# Altium project programmer.PrjPcb
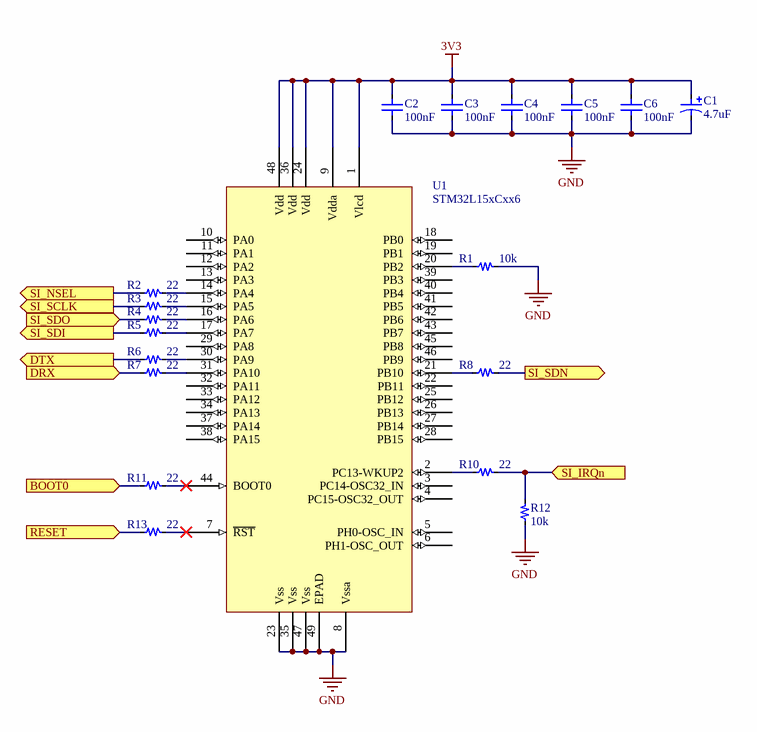
[diagram p0: microcontroller.SchDoc]
ProjectDate: 30/05/2018; ProjectDescription: Oxidane module programmer; ProjectLicense: GPL; ProjectPCBRev: A; ProjectRevision: 0; ProjectTitle: Rusty
2 sheets, 38 parts. Net scope: flat (ports and power ports of the same name join across sheets).
Board file: board.PcbDoc
Sheets:
  microcontroller.SchDoc
  radio.SchDoc

## Sheet microcontroller.SchDoc: Microcontroller
size A4; Author: Pietro Lorefice; DocumentNumber: 2; Revision: A; SheetNumber: 2; SheetTotal: 3

### Parts
C1  4.7uF  [0603_[1608]]
C2  100nF  [0402_[1005]]
C3  100nF  [0402_[1005]]
C4  100nF  [0402_[1005]]
C5  100nF  [0402_[1005]]
C6  100nF  [0402_[1005]]
R1  10k  [0402_[1005]]
R2  22  [0402_[1005]]
R3  22  [0402_[1005]]
R4  22  [0402_[1005]]
R5  22  [0402_[1005]]
R6  22  [0402_[1005]]
R7  22  [0402_[1005]]
R8  22  [0402_[1005]]
R10  22  [0402_[1005]]
R11  22  [0402_[1005]]
R12  10k  [0402_[1005]]
R13  22  [0402_[1005]]
U1  STM32L15xCxx6  [QFN50P700X700X60_HS-49N]

### Ports
BOOT0 (in), DRX (in), DTX (out), RESET (in), SI_IRQn (in), SI_NSEL (out), SI_SCLK (out), SI_SDI (out), SI_SDN (out), SI_SDO (in)

### Nets
3V3: C1.1 C2.2 C3.2 C4.2 C5.2 C6.2 U1.1(Vlcd) U1.9(Vdda) U1.24(Vdd) U1.36(Vdd) U1.48(Vdd)
GND: C1.2 C2.1 C3.1 C4.1 C5.1 C6.1 R1.2 R12.1 U1.8(Vssa) U1.23(Vss) U1.35(Vss) U1.47(Vss) U1.49(EPAD)
BOOT0: R11.1 ; port BOOT0
DRX: R7.1 ; port DRX
DTX: R6.1 ; port DTX
RESET: R13.1 ; port RESET
SI_IRQn: R10.2 R12.2 ; port SI_IRQn
SI_NSEL: R2.1 ; port SI_NSEL
SI_SCLK: R3.1 ; port SI_SCLK
SI_SDI: R5.1 ; port SI_SDI
SI_SDN: R8.2 ; port SI_SDN
SI_SDO: R4.1 ; port SI_SDO
NetR1_1: R1.1 U1.20(PB2)
NetR2_2: R2.2 U1.14(PA4)
NetR3_2: R3.2 U1.15(PA5)
NetR4_2: R4.2 U1.16(PA6)
NetR5_2: R5.2 U1.17(PA7)
NetR6_2: R6.2 U1.30(PA9)
NetR7_2: R7.2 U1.31(PA10)
NetR8_1: R8.1 U1.21(PB10)
NetR10_1: R10.1 U1.2(PC13-WKUP2)
NetR11_2: R11.2 U1.44(BOOT0)
NetR13_2: R13.2 U1.7(~{RST})

Not connected (* = marked no-connect by the designer): U1 3(PC14-OSC32_IN) 4(PC15-OSC32_OUT) 5(PH0-OSC_IN) 6(PH1-OSC_OUT) 10(PA0) 11(PA1) 12(PA2) 13(PA3) 18(PB0) 19(PB1) 22(PB11) 25(PB12) 26(PB13) 27(PB14) 28(PB15) 29(PA8) 32(PA11) 33(PA12) 34(PA13) 37(PA14) 38(PA15) 39(PB3) 40(PB4) 41(PB5) 42(PB6) 43(PB7) 45(PB8) 46(PB9)

### Notes on the sheet
- Title
- Project
- Size:
- Date:
- A4
- Number:
- Time:
- Revision:
- Sheet
- of
- Author:

### Library data of the parts
C1 = CPOL: Polarized capacitor; Value: 4.7uF
C2-C6 = C: Capacitor; Value: 100nF
R1-R8 R10-R13 = R: Resistor
  R1 R12: Value: 10k
  R2-R8 R10 R11 R13: Value: 22
U1 = STM32L15xCxx6: Ultra-low-power 32-bit MCU ARM®-based Cortex®-M3, 128KB Flash, 16KB SRAM, 4KB EEPROM, LCD, USB, ADC, DAC

## Sheet radio.SchDoc: Radio
size A4; Author: Pietro Lorefice; DocumentNumber: 3; Revision: A; SheetNumber: 3; SheetTotal: 3
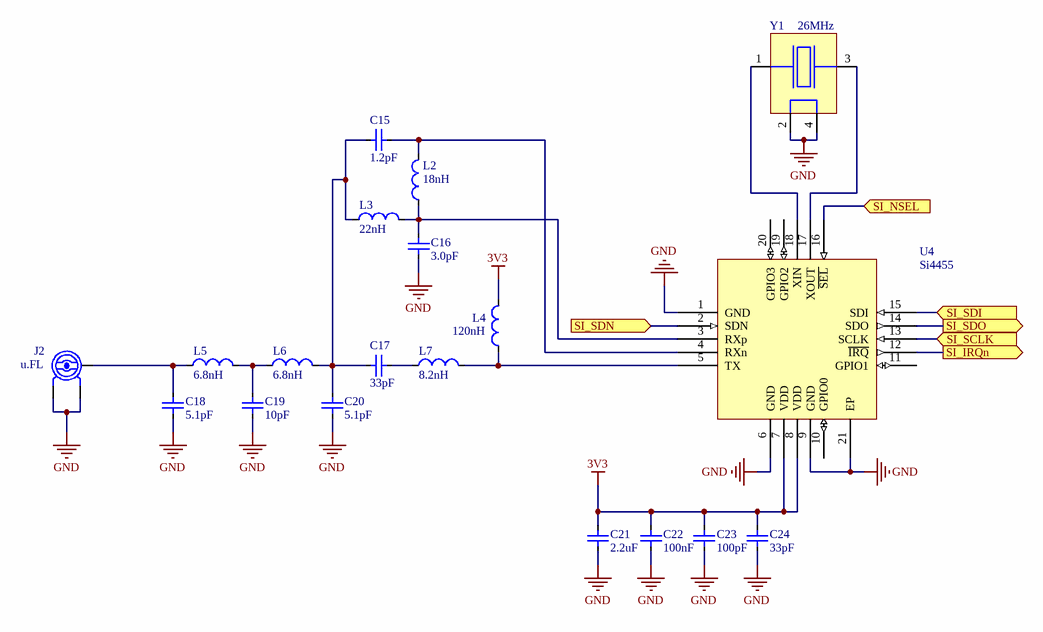
[diagram p1: radio.SchDoc]

### Parts
C15  1.2pF  [0402_[1005]]
C16  3.0pF  [0402_[1005]]
C17  33pF  [0402_[1005]]
C18  5.1pF  [0402_[1005]]
C19  10pF  [0402_[1005]]
C20  5.1pF  [0402_[1005]]
C21  2.2uF  [0603_[1608]]
C22  100nF  [0402_[1005]]
C23  100pF  [0402_[1005]]
C24  33pF  [0402_[1005]]
J2  u.FL  [U.FL_COAXIAL_2.6x2.6MM_STRAIGHT_SMD]
L2  18nH  [0402_[1005]]
L3  22nH  [0402_[1005]]
L4  120nH  [0402_[1005]]
L5  6.8nH  [0402_[1005]]
L6  6.8nH  [0402_[1005]]
L7  8.2nH  [0402_[1005]]
U4  Si4455  [QFN50P300X300X90_HS-21N]
Y1  26MHz  [CRYSTAL_2.5X2MM_4P_SMD]

### Ports
SI_IRQn (out), SI_NSEL (in), SI_SCLK (in), SI_SDI (in), SI_SDN (in), SI_SDO (out)

### Nets
3V3: C21.2 C22.2 C23.2 C24.2 L4.2 U4.7(VDD) U4.8(VDD)
GND: C16.1 C18.1 C19.1 C20.1 C21.1 C22.1 C23.1 C24.1 J2.2(GND) J2.3(GND) U4.1(GND) U4.6(GND) U4.9(GND) U4.21(EP) Y1.2 Y1.4
SI_IRQn: U4.12(~{IRQ}) ; port SI_IRQn
SI_NSEL: U4.16(~{SEL}) ; port SI_NSEL
SI_SCLK: U4.13(SCLK) ; port SI_SCLK
SI_SDI: U4.15(SDI) ; port SI_SDI
SI_SDN: U4.2(SDN) ; port SI_SDN
SI_SDO: U4.14(SDO) ; port SI_SDO
NetC15_1: C15.1 C17.1 C20.2 L3.1 L6.2
NetC15_2: C15.2 L2.2 U4.4(RXn)
NetC16_2: C16.2 L2.1 L3.2 U4.3(RXp)
NetC17_2: C17.2 L7.1
NetC18_2: C18.2 J2.1(SIG) L5.1
NetC19_2: C19.2 L5.2 L6.1
NetL4_1: L4.1 L7.2 U4.5(TX)
NetU4_17: U4.17(XOUT) Y1.3
NetU4_18: U4.18(XIN) Y1.1

Not connected (* = marked no-connect by the designer): U4 10(GPIO0) 11(GPIO1) 19(GPIO2) 20(GPIO3)

### Notes on the sheet
- Title
- Project
- Size:
- Date:
- A4
- Number:
- Time:
- Revision:
- Sheet
- of
- Author:

### Library data of the parts
C15-C24 = C: Capacitor
  C15: Value: 1.2pF
  C16: Value: 3.0pF
  C17 C24: Value: 33pF
  C18 C20: Value: 5.1pF
  C19: Value: 10pF
  C21: Value: 2.2uF
  C22: Value: 100nF
  C23: Value: 100pF
J2 = u.FL: u.FL antenna connector; pin to pad: 1>3 3>1
L2-L7 = L: Inductor
  L2: Value: 18nH
  L3: Value: 22nH
  L4: Value: 120nH
  L5 L6: Value: 6.8nH
  L7: Value: 8.2nH
U4 = Si4455: Low-current OOK/(G)FSK sub-GHz transceiver
Y1 = XTAL-4: Crystal oscillator, 4-pin; Value: 26MHz

## Nets that join several sheets
3V3: microcontroller (11 pins), radio (7 pins)
GND: microcontroller (13 pins), radio (16 pins)
SI_IRQn: microcontroller (R10.2 R12.2), radio (U4.12)
SI_NSEL: microcontroller (R2.1), radio (U4.16)
SI_SCLK: microcontroller (R3.1), radio (U4.13)
SI_SDI: microcontroller (R5.1), radio (U4.15)
SI_SDN: microcontroller (R8.2), radio (U4.2)
SI_SDO: microcontroller (R4.1), radio (U4.14)